# Altium schematic sheet connectors.SchDoc
size A
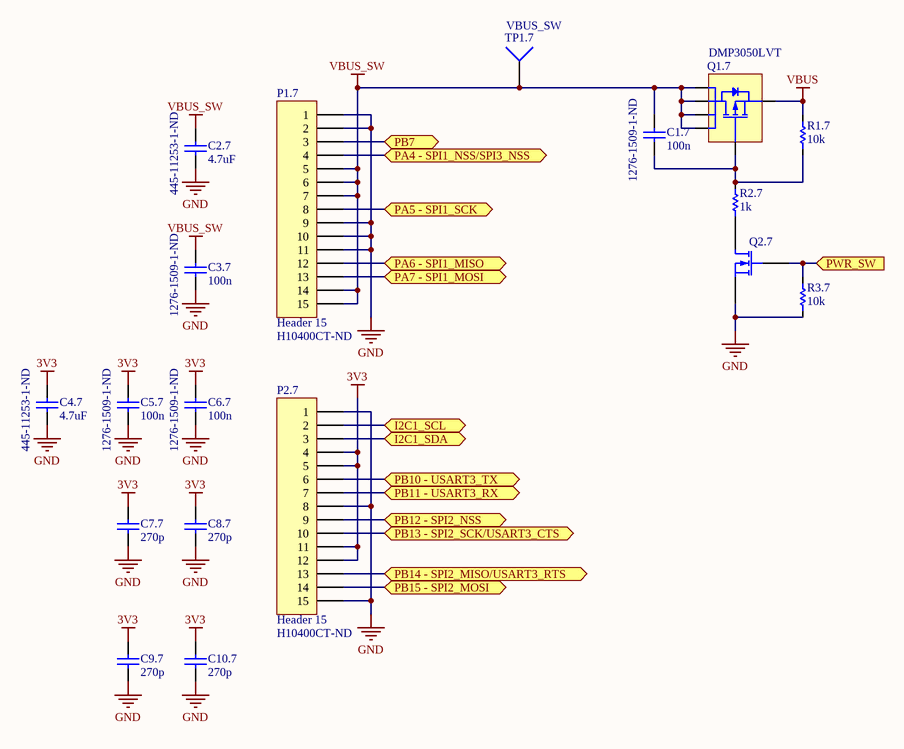
[diagram p0: connectors.SchDoc]

## Parts
C1.7  Supplier Part Number 1: 1276-1509-1-ND  [0402]  (hidden comment: 100n)
C2.7  4.7uF  Supplier Part Number 1: 445-11253-1-ND  [1608[0603]]
C3.7  Supplier Part Number 1: 1276-1509-1-ND  [0402]  (hidden comment: 100n)
C4.7  4.7uF  Supplier Part Number 1: 445-11253-1-ND  [1608[0603]]
C5.7  Supplier Part Number 1: 1276-1509-1-ND  [0402]  (hidden comment: 100n)
C6.7  Supplier Part Number 1: 1276-1509-1-ND  [0402]  (hidden comment: 100n)
C7.7  270p  [0402]
C8.7  270p  [0402]
C9.7  270p  [0402]
C10.7  270p  [0402]
P1.7  Header 15  Supplier Part Number 1: H10400CT-ND  [DF9-15S-1V]
P2.7  Header 15  Supplier Part Number 1: H10400CT-ND  [DF9-15S-1V]
Q1.7  DMP3050LVT  [SOT95P280X100-6N]
Q2.7  2N7002  [SOT23]  (value not drawn)
R1.7  10k  [0402]
R2.7  1k  [0402]
R3.7  10k  [0402]
TP1.7  VBUS_SW  [Test Point Target 1mm]  (no BOM)

## Ports
I2C1_SCL (bidir), I2C1_SDA (bidir), PA4 - SPI1_NSS/SPI3_NSS (bidir), PA5 - SPI1_SCK (bidir), PA6 - SPI1_MISO (bidir), PA7 - SPI1_MOSI (bidir), PB7 (bidir), PB10 - USART3_TX (bidir), PB11 - USART3_RX (bidir), PB12 - SPI2_NSS (bidir), PB13 - SPI2_SCK/USART3_CTS (bidir), PB14 - SPI2_MISO/USART3_RTS (bidir), PB15 - SPI2_MOSI (bidir), PWR_SW (in)

## Nets
3V3: C4.7.2 C5.7.1 C6.7.1 C7.7.2 C8.7.2 C9.7.2 C10.7.2 P2.7.4 P2.7.5 P2.7.11 P2.7.12
GND: C2.7.1 C3.7.2 C4.7.1 C5.7.2 C6.7.2 C7.7.1 C8.7.1 C9.7.1 C10.7.1 P1.7.1 P1.7.2 P1.7.9 P1.7.10 P1.7.11 P2.7.1 P2.7.8 P2.7.15 Q2.7.2(S) R3.7.1
VBUS: Q1.7.4(S) R1.7.2
VBUS_SW: C1.7.1 C2.7.2 C3.7.1 P1.7.5 P1.7.6 P1.7.7 P1.7.14 P1.7.15 Q1.7.1(D) Q1.7.2(D) Q1.7.5(D) Q1.7.6(D) TP1.7.1
I2C1_SCL: P2.7.2 ; port I2C1_SCL
I2C1_SDA: P2.7.3 ; port I2C1_SDA
PA4 - SPI1_NSS/SPI3_NSS: P1.7.4 ; port PA4 - SPI1_NSS/SPI3_NSS
PA5 - SPI1_SCK: P1.7.8 ; port PA5 - SPI1_SCK
PA6 - SPI1_MISO: P1.7.12 ; port PA6 - SPI1_MISO
PA7 - SPI1_MOSI: P1.7.13 ; port PA7 - SPI1_MOSI
PB7: P1.7.3 ; port PB7
PB10 - USART3_TX: P2.7.6 ; port PB10 - USART3_TX
PB11 - USART3_RX: P2.7.7 ; port PB11 - USART3_RX
PB12 - SPI2_NSS: P2.7.9 ; port PB12 - SPI2_NSS
PB13 - SPI2_SCK/USART3_CTS: P2.7.10 ; port PB13 - SPI2_SCK/USART3_CTS
PB14 - SPI2_MISO/USART3_RTS: P2.7.13 ; port PB14 - SPI2_MISO/USART3_RTS
PB15 - SPI2_MOSI: P2.7.14 ; port PB15 - SPI2_MOSI
PWR_SW: Q2.7.3(G) R3.7.2 ; port PWR_SW
NetC1.7_2: C1.7.2 Q1.7.3(G) R1.7.1 R2.7.2
NetQ2.7_1: Q2.7.1(D) R2.7.1

## Library data of the parts
C1.7 C3.7 C5.7 C6.7 C7.7 C8.7 C9.7 C10.7 = CAPACITOR NON_POL
  C1.7 C3.7 C5.7 C6.7: Value: 100n; Supplier 1: Digi-Key
  C7.7 C8.7 C9.7 C10.7: Value: 270p
C2.7 C4.7 = C0402: Value: 4.7uF; Supplier 1: Digi-Key
P1.7 P2.7 = Header 15: Header, 15-Pin; LatestRevisionDate: 17-Jul-2002; LatestRevisionNote: Re-released for DXP Platform.; Publisher: Altium Limited; Supplier 1: Digi-Key
Q2.7 = 2N7002: N-Channel Enhancement Mode Vertical DMOS FET; Supplier 1: Digi-Key; Supplier Part Number 1: 2N7002-TPMSCT-ND
R1.7 R3.7 = RESISTOR: Manufacturer: Yageo; Manufacturer Part Number: RC0402JR-0710KL; Tolerance: ±5%; Power (Watts): 0.063W, 1/16W; Temperature Coefficient: ±100ppm/°C; Value: 10k; Supplier 1: Digi-Key; Supplier Part Number 1: 311-10KJRCT-ND; Pricing 1: 1=0.1, 10=0.012, 25=0.0084, 100=0.0047, 250=0.0036, 500=0.0029, 1000=0.00213, 2500=0.00185, 5000=0.00153 (USD); Packaging: Cut Tape (CT); Resistance (Ohms): 10k; Composition: Thick Film; Features: Moisture Resistant; Operating Temperature: -55°C ~ 155°C; Package / Case: 0402 (1005 Metric); Supplier Device Package: 0402; Size / Dimension: 0.039" L x 0.020" W (1.00mm x 0.50mm); Height: 0.016" (0.40mm); Number of Terminations: 2; ComponentLink1URL: http://www.yageo.com/documents/recent/PYu-RC_Group_51_RoHS_L_04.pdf; ComponentLink1Description: http://www.yageo.com/documents/recent/PYu-RC_Group_51_RoHS_L_04.pdf
R2.7 = RESISTOR: Value: 1k
TP1.7 = Socket: LatestRevisionDate: 17-Jul-2002; LatestRevisionNote: Re-released for DXP Platform.; Publisher: Altium Limited